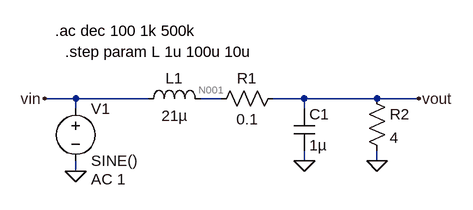
[diagram p0: schematic classD-LC.asc]
classD-LC.asc, the LTspice schematic file:
Version 4
SHEET 1 880 680
WIRE -240 112 -288 112
WIRE -128 112 -240 112
WIRE -16 112 -48 112
WIRE 112 112 64 112
WIRE 224 112 112 112
WIRE 288 112 224 112
WIRE -240 128 -240 112
WIRE 112 128 112 112
WIRE 112 208 112 192
WIRE 224 208 224 192
WIRE -240 224 -240 208
FLAG 112 208 0
FLAG -288 112 vin
FLAG 288 112 vout
FLAG -240 224 0
FLAG 224 208 0
SYMBOL ind -144 128 R270
WINDOW 0 32 56 VTop 2
WINDOW 3 5 56 VBottom 2
SYMATTR InstName L1
SYMATTR Value 21µ
SYMBOL cap 96 128 R0
SYMATTR InstName C1
SYMATTR Value 1µ
SYMBOL res 80 96 R90
WINDOW 0 0 56 VBottom 2
WINDOW 3 32 56 VTop 2
SYMATTR InstName R1
SYMATTR Value 0.1
SYMBOL voltage -240 112 R0
WINDOW 123 24 124 Left 2
WINDOW 39 0 0 Left 0
SYMATTR Value2 AC 1
SYMATTR InstName V1
SYMATTR Value SINE()
SYMBOL res 208 96 R0
SYMATTR InstName R2
SYMATTR Value 4
TEXT -272 8 Left 2 !.ac dec 100 1k 500k
TEXT -256 40 Left 2 !.step param L 1u 100u 10u

The netlist it stands for:
* classD-LC.asc
L1 vin N001 21µ
C1 vout 0 1µ
R1 vout N001 0.1
V1 vin 0 SINE() AC 1
R2 vout 0 4
.ac dec 100 1k 500k
.step param L 1u 100u 10u
.backanno
.end

* Results of the author's LTspice run, read from the files saved beside the schematic
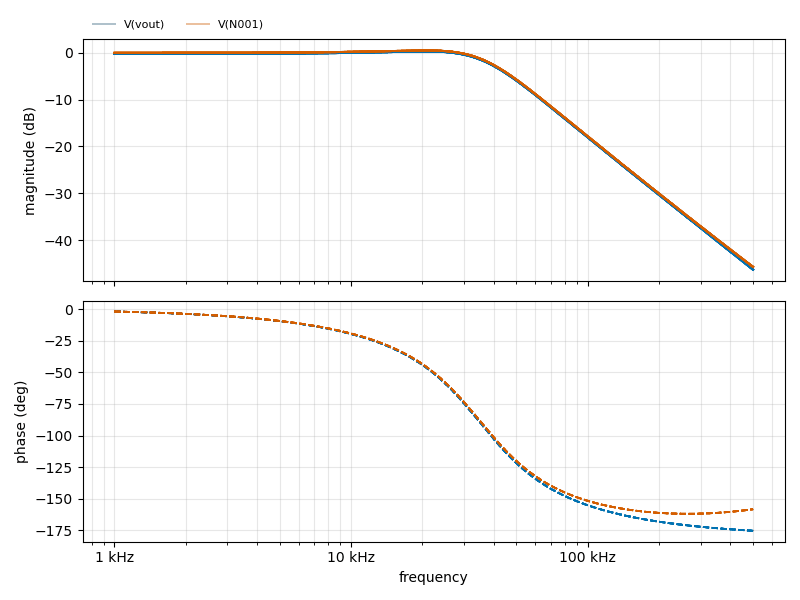
[diagram p1: AC Analysis of classD-LC.asc, plotted from the saved traces]
* AC Analysis, 11 runs:
*   V(vout) [run 1]: -0.21 dB at 1 kHz, -46.32 dB at 500 kHz, peak 0.30 dB at 20.42 kHz, 3 dB below the peak at 39.74 kHz
*   V(vout) [run 2]: -0.21 dB at 1 kHz, -46.32 dB at 500 kHz, peak 0.30 dB at 20.42 kHz, 3 dB below the peak at 39.74 kHz
*   V(vout) [run 3]: -0.21 dB at 1 kHz, -46.32 dB at 500 kHz, peak 0.30 dB at 20.42 kHz, 3 dB below the peak at 39.74 kHz
*   V(vout) [run 4]: -0.21 dB at 1 kHz, -46.32 dB at 500 kHz, peak 0.30 dB at 20.42 kHz, 3 dB below the peak at 39.74 kHz
*   V(vout) [run 5]: -0.21 dB at 1 kHz, -46.32 dB at 500 kHz, peak 0.30 dB at 20.42 kHz, 3 dB below the peak at 39.74 kHz
*   V(vout) [run 6]: -0.21 dB at 1 kHz, -46.32 dB at 500 kHz, peak 0.30 dB at 20.42 kHz, 3 dB below the peak at 39.74 kHz
*   V(vout) [run 7]: -0.21 dB at 1 kHz, -46.32 dB at 500 kHz, peak 0.30 dB at 20.42 kHz, 3 dB below the peak at 39.74 kHz
*   V(vout) [run 8]: -0.21 dB at 1 kHz, -46.32 dB at 500 kHz, peak 0.30 dB at 20.42 kHz, 3 dB below the peak at 39.74 kHz
*   V(N001) [run 1]: 0.00 dB at 1 kHz, -45.71 dB at 500 kHz, peak 0.52 dB at 20.42 kHz, 3 dB below the peak at 39.75 kHz
*   V(N001) [run 2]: 0.00 dB at 1 kHz, -45.71 dB at 500 kHz, peak 0.52 dB at 20.42 kHz, 3 dB below the peak at 39.75 kHz
*   V(N001) [run 3]: 0.00 dB at 1 kHz, -45.71 dB at 500 kHz, peak 0.52 dB at 20.42 kHz, 3 dB below the peak at 39.75 kHz
*   V(N001) [run 4]: 0.00 dB at 1 kHz, -45.71 dB at 500 kHz, peak 0.52 dB at 20.42 kHz, 3 dB below the peak at 39.75 kHz
*   V(N001) [run 5]: 0.00 dB at 1 kHz, -45.71 dB at 500 kHz, peak 0.52 dB at 20.42 kHz, 3 dB below the peak at 39.75 kHz
*   V(N001) [run 6]: 0.00 dB at 1 kHz, -45.71 dB at 500 kHz, peak 0.52 dB at 20.42 kHz, 3 dB below the peak at 39.75 kHz
*   V(N001) [run 7]: 0.00 dB at 1 kHz, -45.71 dB at 500 kHz, peak 0.52 dB at 20.42 kHz, 3 dB below the peak at 39.75 kHz
*   V(N001) [run 8]: 0.00 dB at 1 kHz, -45.71 dB at 500 kHz, peak 0.52 dB at 20.42 kHz, 3 dB below the peak at 39.75 kHz